# EAGLE schematic boardv2connectors (EAGLE 6.6.0)
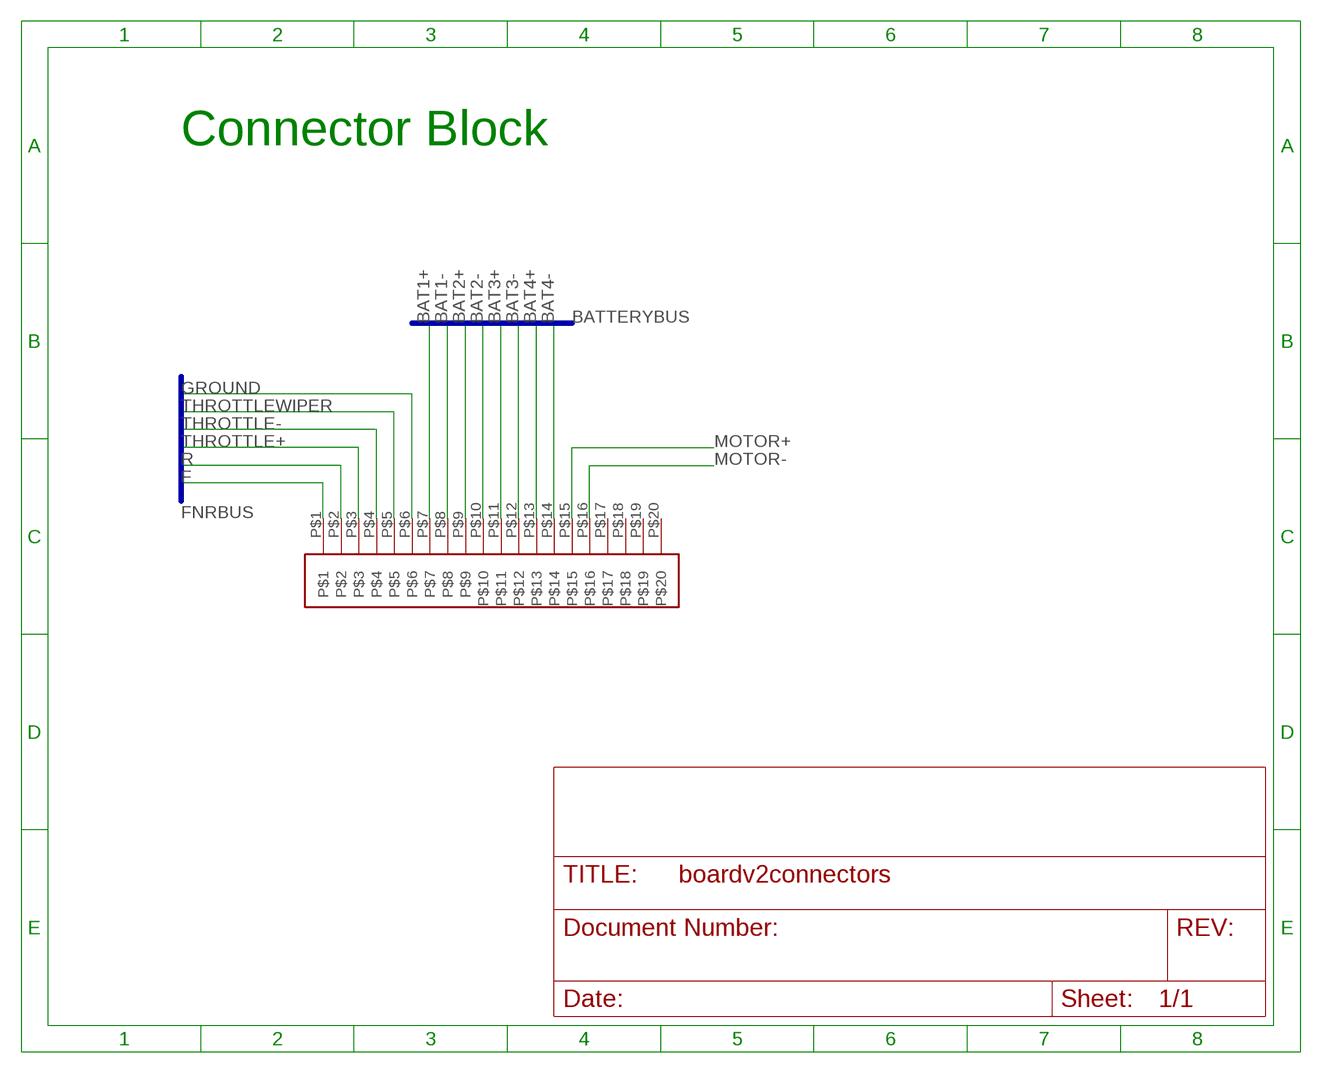
[diagram p0: schematic, sheet 1]

## Parts
U$1  34830-2001  [34830-2001]

## Nets
BAT1+: U$1.P$7
BAT1-: U$1.P$8
BAT2+: U$1.P$9
BAT2-: U$1.P$10
BAT3+: U$1.P$11
BAT3-: U$1.P$12
BAT4+: U$1.P$13
BAT4-: U$1.P$14
F: U$1.P$1
GROUND: U$1.P$6
MOTOR+: U$1.P$15
MOTOR-: U$1.P$16
R: U$1.P$2
THROTTLE+: U$1.P$3
THROTTLE-: U$1.P$4
THROTTLEWIPER: U$1.P$5
Unconnected: U$1.P$17 U$1.P$18 U$1.P$19 U$1.P$20

## Buses
BATTERYBUS
FNRBUS

## Notes on the sheet
- Connector Block

## Library data of the parts
U$1 = connectors:34830-2001